# EAGLE design tweeq-extMod_mTouch_2chLinearE (EAGLE 6.4)
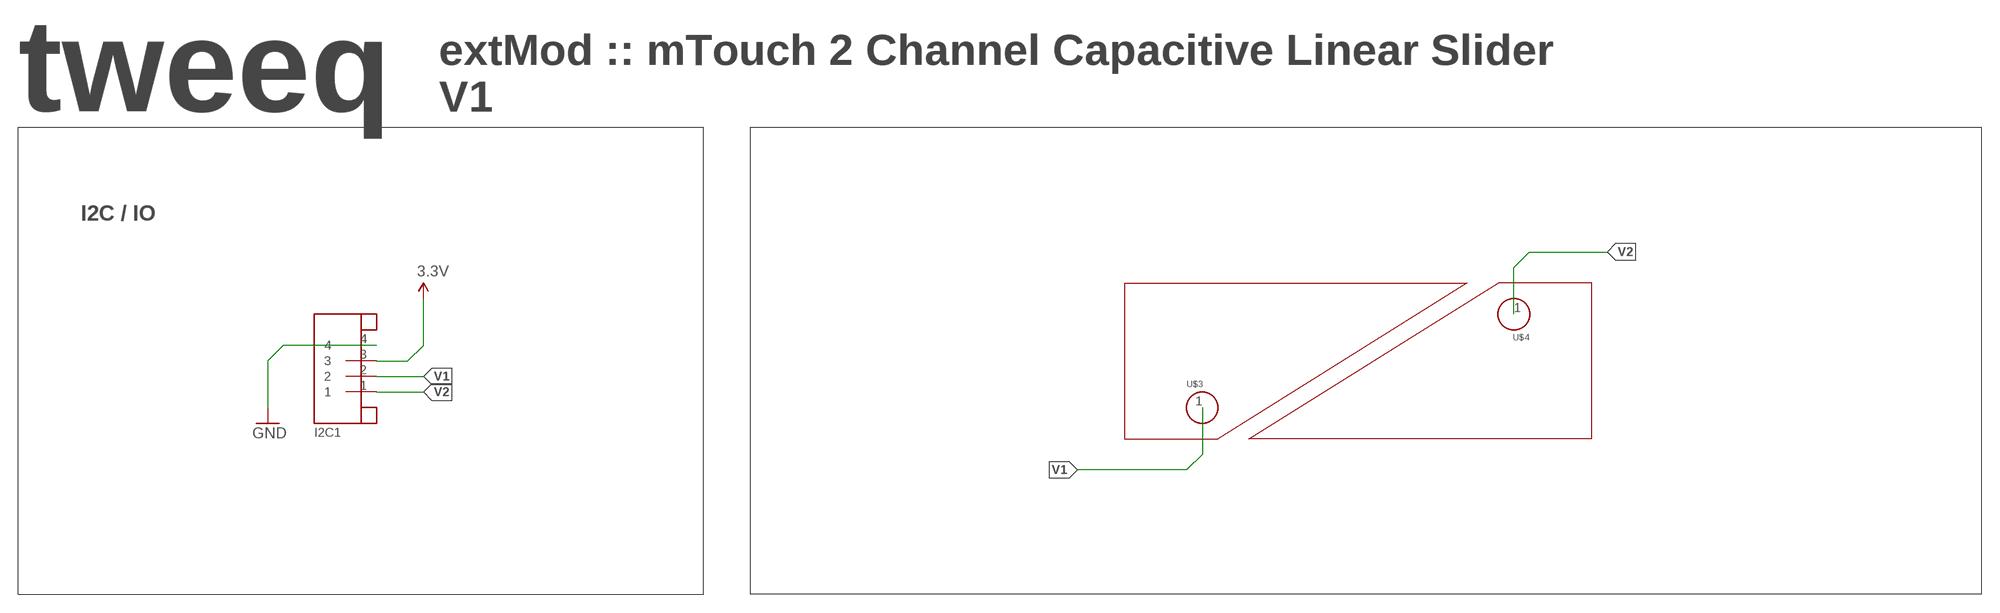
[diagram p0: schematic, sheet 1]

## Parts
I2C1  JST-4PINSH  [SH1.0-4PIN]
U$3  MTOUCH_VIA  [MTOUCH_VIA]
U$4  MTOUCH_VIA  [MTOUCH_VIA]

## Nets
3.3V: I2C1.3
GND: I2C1.4
V1: I2C1.2 U$3.1
V2: I2C1.1 U$4.1

## Notes on the sheet
- extMod :: mTouch 2 Channel Capacitive Linear Slider
- tweeq | V1
- I2C-1
- I2C / IO
- I2C-2

## Library data of the parts
I2C1 = AISCube:JST-4PIN: JST 4 Pin
U$3 U$4 = AISCube:MTOUCH_VIA

## Board
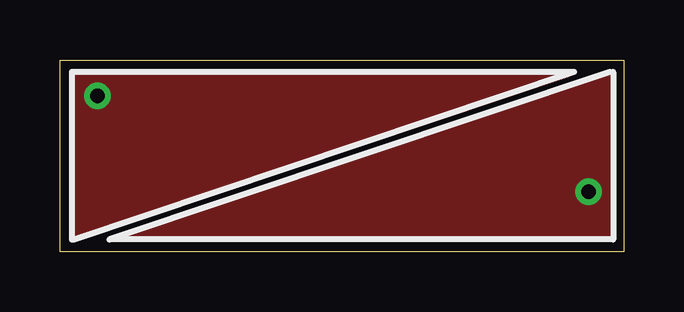
[diagram p1: board, top side]
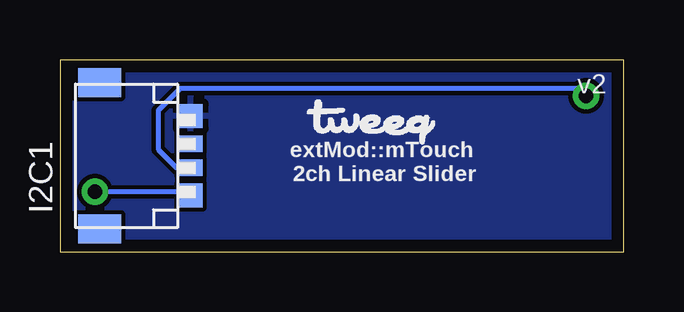
[diagram p2: board, bottom side, seen from below]

Size 23.5 x 8 mm. Coordinates in mm from the lower left corner, seen from the top.
Outline: 0,8 23.5,8 23.5,0 0,0 0,8
Copper layers (1*16): Top 0.0356mm / dielectric 1.5011mm / Bottom 0.0356mm
Design rules "AISCube": minimum track width 7mil, minimum drill 14mil, track to track 7mil, track to pad 7mil, pad to pad 7mil, via to via 7mil, smd to smd 0mil, copper to edge 20mil, drill to drill 8mil, minimum pad ring 10mil, minimum via ring 8mil, stop-mask expansion 4mil, vias tented up to drill 32mil, thermal gap 10mil

### Footprints (pad centres in the part's own frame; a part is rotated, then mirrored left to right if it is on the bottom)
SH1.0-4PIN = smd 1 x 1: 1 -1.65,-0.55; 4 1.65,-0.55 | smd 0.7 x 1: 2 -0.5,-0.55; 3 0.5,-0.55 | smd 1.2 x 1.8: P$1 -3.05,3.25; P$2 3.05,3.25
MTOUCH_VIA = drill 0.6: 1 0,0

### Placement (x,y rotation side)
I2C1  18.6,4 90 bottom
U$1  [TWEEQ-LOGO-S]  13.21,4.47 0 bottom
U$3  1.56,6.5 0 top
U$4  22.04,2.5 0 top

### Tracks (layer width: path | path; a pad name or v marks a point on that pad's centre or on a via)
GND
  pour Bottom: 0.3,7.72 23.27,7.72 23.27,0.2 0.3,0.2
V1
  Bottom 0.203: U$3.1 1.87,6.81 18.49,6.81 19.41,5.89 19.41,4.27 18.64,3.5 I2C1.2
  pour Top (no thermals): 0.51,7.52 0.51,0.51 21.49,7.52
V2
  Bottom 0.203: I2C1.1 18.2,2.5 U$4.1
  pour Top (no thermals): 2.08,0.51 23.06,7.52 23.06,0.51

### Text on the board
bPlace: v2 | extMod::mTouch / 2ch Linear Slider